# EAGLE design cociclo_wemos_2016_final_2 (EAGLE 7.2.0)
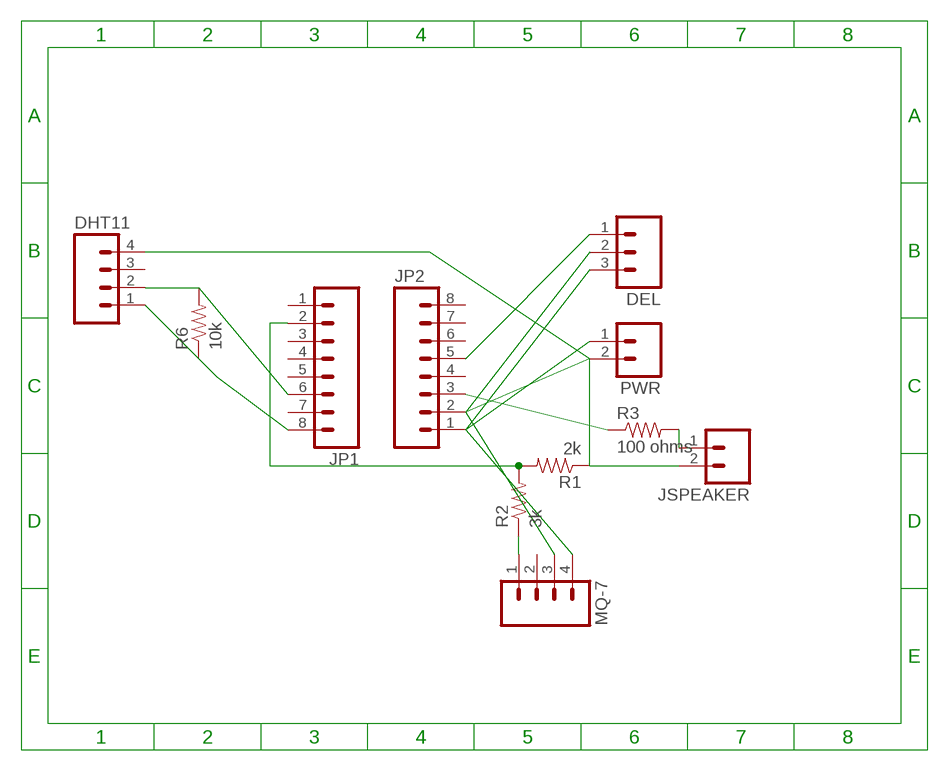
[diagram p0: schematic, sheet 1]

## Parts
DEL  M03PTH  [1X03]
DHT11  M04PTH  [1X04]
JP1  M08  [1X08_ROUND]
JP2  M08  [1X08_ROUND]
JSPEAKER  M02PTH  [1X02]
MQ-7  M04PTH  [1X04]
PWR  M02LOCK_LONGPADS  [1X02_LOCK_LONGPADS]
R1  2k  RESISTOR1206  [1206]
R2  3k  RESISTOR1206  [1206]
R3  100 ohms  RESISTOR1206  [1206]
R6  10k  RESISTOR1206  [1206]

## Nets
ADC: JP1.2 R1.2 R2.2
CH_PD: DHT11.1 JP1.8 R6.1
GND: DEL.2 DHT11.4 JP2.2 JSPEAKER.2 MQ-7.3 PWR.2 R1.1
GPIO12: JP2.3 R3.1
GPIO14: DHT11.2 JP1.6 R6.2
LDO_EN: DEL.3 JP2.1 MQ-7.4 PWR.1
N$1: MQ-7.1 R2.1
N$3: DEL.1 JP2.5
N$4: JSPEAKER.1 R3.2
Unconnected: DHT11.3 JP1.1 JP1.3 JP1.4 JP1.5 JP1.7 JP2.4 JP2.6 JP2.7 JP2.8 MQ-7.2

## Library data of the parts
DEL = SparkFun-Connectors:M03: Header 3 Standard 3-pin 0.1" header. Use with straight break away headers (SKU : PRT-00116), right angle break away headers (PRT-00553), swiss pins (PRT-00743), machine pins (PRT-00117), and female headers (PRT-00115). Molex polarized connector foot print use with SKU : PRT-08232 with associated crimp pins and housings.
DHT11 MQ-7 = SparkFun-Connectors:M04: Header 4 Standard 4-pin 0.1" header. Use with straight break away headers (SKU : PRT-00116), right angle break away headers (PRT-00553), swiss pins (PRT-00743), machine pins (PRT-00117), and female headers (PRT-00115). Molex polarized connector foot print use with SKU : PRT-08231 with associated crimp pins and housings. 1MM SMD Version SKU: PRT-10208
JP1 JP2 = SparkFun-Connectors:M08: Header 8 Standard 8-pin 0.1" header. Use with straight break away headers (SKU : PRT-00116), right angle break away headers (PRT-00553), swiss pins (PRT-00743), machine pins (PRT-00117), and female headers (PRT-00115).
JSPEAKER PWR = SparkFun-Connectors:M02: Standard 2-pin 0.1" header. Use with - straight break away headers ( PRT-00116) - right angle break away headers (PRT-00553) - swiss pins (PRT-00743) - machine pins (PRT-00117) - female headers (PRT-00115) Molex polarized connector foot print use with: PRT-08233 with associated crimp pins and housings. 2.54_SCREWTERM for use with PRT-10571. 3.5mm Screw Terminal footprints for PRT-08084 5mm Screw Terminal footprints for use with PRT-08432
R1-R3 R6 = SparkFun-Resistors:RESISTOR: Resistor Basic schematic elements and footprints for 0603, 1206, and PTH resistors.

## Board
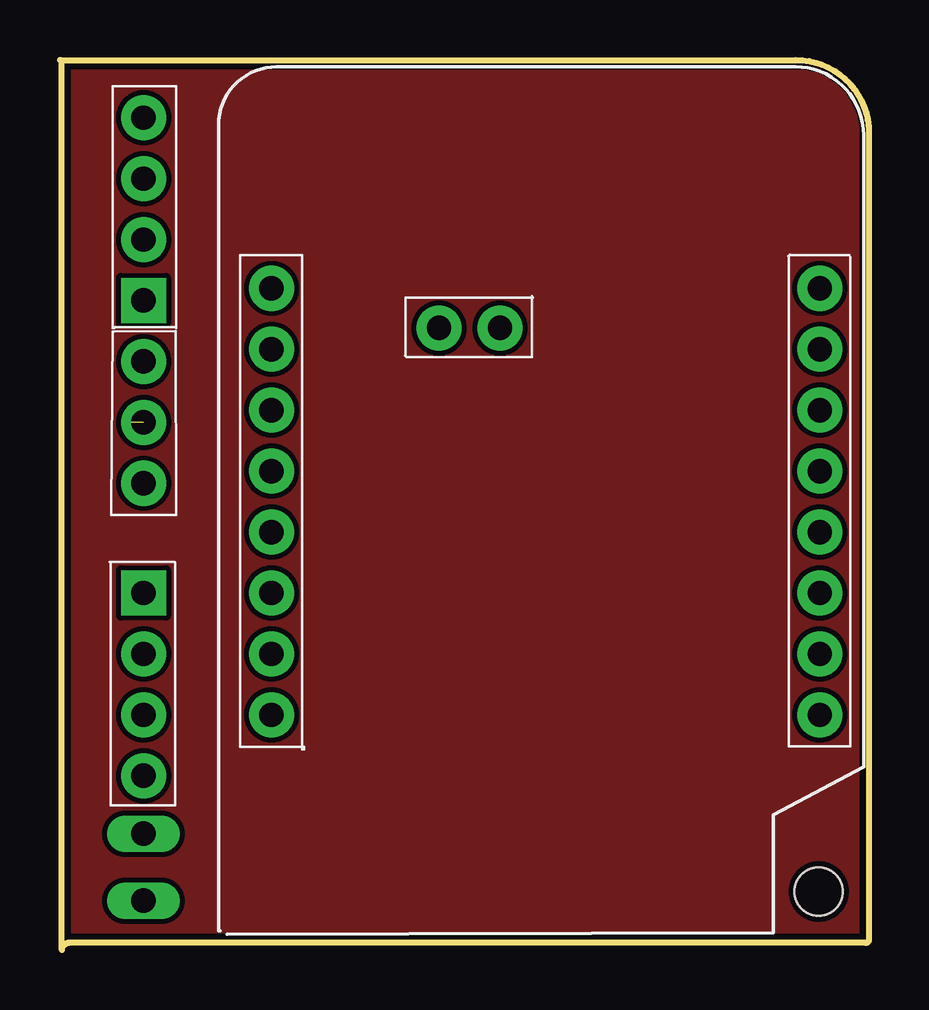
[diagram p1: board, top side]
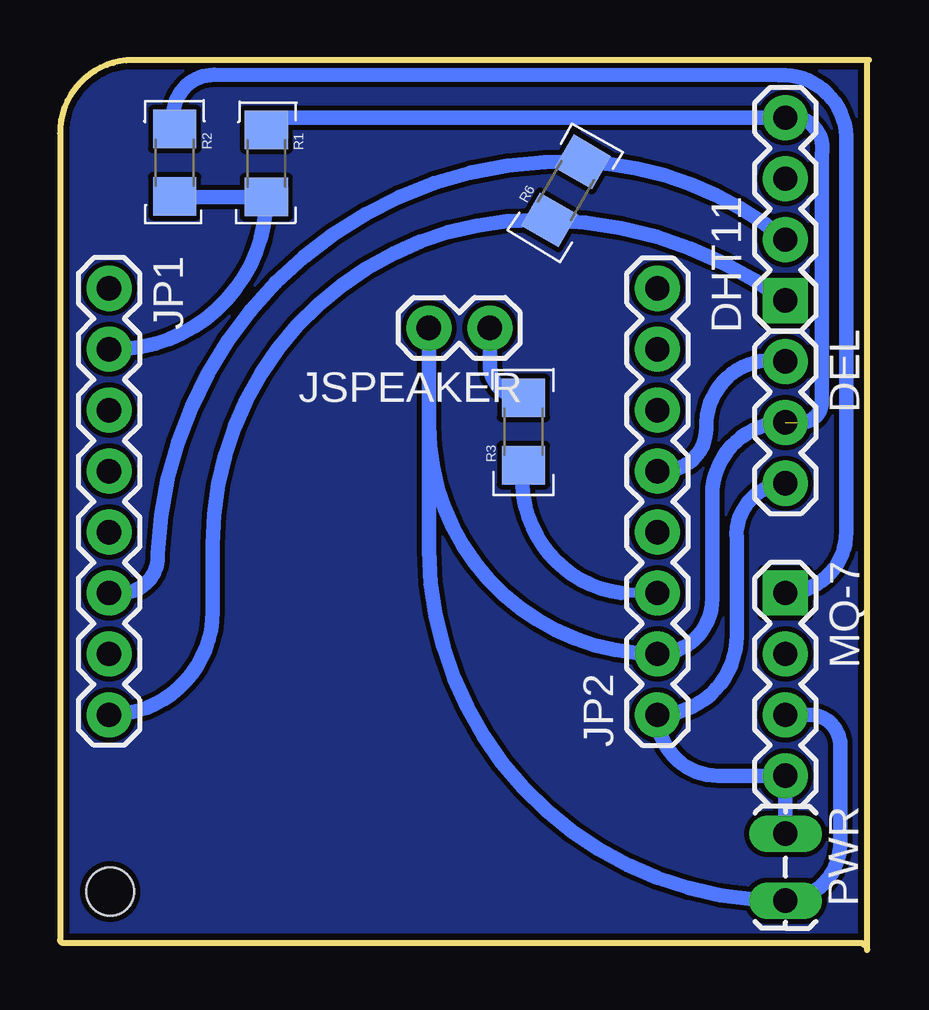
[diagram p2: board, bottom side, seen from below]

Size 33.73 x 37.1 mm. Coordinates in mm from the lower left corner, seen from the top.
Outline: 0.08,0.08 0.08,37.02 arc90 0,37.1 30.67,37.1 arc-90 33.73,34.04 33.73,0.44 arc-90 33.58,0.29 0.37,0.29 arc90 0.08,0 0.08,0.08
Outline: 0.08,0.08 arc-90 0.22,0.22
Copper layers (1*16): Top 0.035mm / dielectric 1.5mm / Bottom 0.035mm
Design rules "adafruit *": minimum track width 10mil, minimum drill 15.5mil, track to track 8mil, track to pad 8mil, pad to pad 8mil, via to via 8mil, smd to smd 8mil, copper to edge 10mil, drill to drill 8mil, minimum pad ring 10mil, minimum via ring 8mil, stop-mask expansion 2mil, vias tented up to drill 20mil, thermal gap 10mil
Holes 2 mm at 31.63,2.43

### Footprints (pad centres in the part's own frame; a part is rotated, then mirrored left to right if it is on the bottom)
1X03 = drill 1.016 pad 1.88: 1 0,0; 2 2.54,0; 3 5.08,0
1X04 = drill 1.016 pad 1.88 square: 1 0,0 | drill 1.016 pad 1.88: 2 2.54,0; 3 5.08,0; 4 7.62,0
1X08_ROUND = drill 1.016 pad 1.88: 1 0,0; 2 2.54,0; 3 5.08,0; 4 7.62,0; 5 10.16,0; 6 12.7,0; 7 15.24,0; 8 17.78,0
1X02 = drill 1.016 pad 1.88: 1 0,0; 2 2.54,0
1X02_LOCK_LONGPADS = drill 1.016 long: 1 -0.127,0; 2 2.667,0
1206 = smd 1.6 x 1.8: 1 -1.4,0; 2 1.4,0

### Placement (x,y rotation side)
DEL  3.48,24.53 270 bottom
DHT11  3.48,27.07 90 bottom
JP1  31.68,27.58 270 bottom
JP2  8.82,9.8 90 bottom
JSPEAKER  15.8,25.93 180 bottom
MQ-7  3.48,14.88 270 bottom
PWR  3.48,4.72 270 bottom
R1  25.12,32.79 270 bottom
R2  28.94,32.82 270 bottom
R3  14.41,21.61 90 bottom
R6  12.63,31.64 60 bottom

### Tracks (layer width: path | path; a pad name or v marks a point on that pad's centre or on a via)
ADC
  Bottom 0.61: JP1.2 31.47,25.04 arc-90 R1.2 28.7,31.39 arc90 28.82,31.51 28.33,31.51 arc90 R2.2
CH_PD
  Bottom 0.406: 13.84,30.43 R6.1
  Bottom 0.61: R6.1 arc35 DHT11.1 | JP1.8 arc-90 27.36,14.12 27.36,16.91 arc90 13.84,30.43
GND  (1 unrouted)
  Bottom 0.61: 2.98,21.99 arc-90 1.96,22.75 1.96,33.17 arc-113 DHT11.4 24.62,34.69 R1.1 | DEL.2 arc-90 6.53,18.94 6.53,14.63 arc90 JP2.2 arc90 18.34,21.86 JSPEAKER.2 18.34,16.66 arc-90 PWR.2 arc-90 1.2,4.59 1.2,8.53 arc-90 2.47,9.8 MQ-7.3
GPIO12
  Bottom 0.406: JP2.3 10.35,14.88
  Bottom 0.61: 10.35,14.88 arc90 R3.1
GPIO14
  Bottom 0.406: JP1.6 31.17,14.88 | 29.65,16.4 29.65,16.53
  Bottom 0.61: DHT11.2 arc-37 R6.2 arc-90 29.65,16.53 | 31.17,14.88 arc-90 29.65,16.4
LDO_EN
  Bottom 0.61: PWR.1 MQ-7.4 6.28,7.26 arc90 JP2.1 arc-90 5.52,13.1 5.52,17.17 arc90 DEL.3
N$1
  Bottom 0.61: MQ-7.1 arc-90 0.94,17.42 0.94,33.93 arc-90 3.74,36.47 27.3,36.48 arc-103 28.96,34.41 arc-134 R2.1
N$2
  pour Top: 0.07,0.15 0,37.1 30.44,37.14 arc-90 33.57,34.18 33.57,33.4 arc90 33.5,33.32 33.54,0.22
N$3
  Bottom 0.406: JP2.5 8.56,19.96
  Bottom 0.61: 8.56,19.96 arc-90 6.79,21.74 arc104 DEL.1
N$4
  Bottom 0.61: JSPEAKER.1 15.8,24.41 arc-90 R3.2
N$5
  pour Bottom: 0.07,0.29 0.01,37.09 30.44,37.17 arc-90 33.5,34.11 33.5,33.82 arc-90 33.64,33.68 33.55,0.11

### Text on the board
uqam: v0.2
noms_b: G | 10k | 2k | 3k | D7 | 3V | DHT11 | A0 | D2 | G | 0.1k | DEL | V+ | D2 | A0 | D4 | D7 | G | 3V3 | G | V+ | V+ | MQ-7 | V+ | G | PWR
192bmp: /Users/uqam/Desktop/ohanda_logo.bmp
noms_t: G | DHT11 | D7 | SPKR | 3V | A0 | D2 | G | DEL | V+ | D2 | A0 | D4 | D7 | G | G | V+ | 3V3 | V+ | MQ-7 | V+ | PWR | G
200bmp: /Users/uqam/Desktop/Artengine_logo_petit_n_b.bmp | /Users/uqam/Desktop/cociclo_logo.bmp